# Altium schematic sheet MCU.SchDoc
size A4
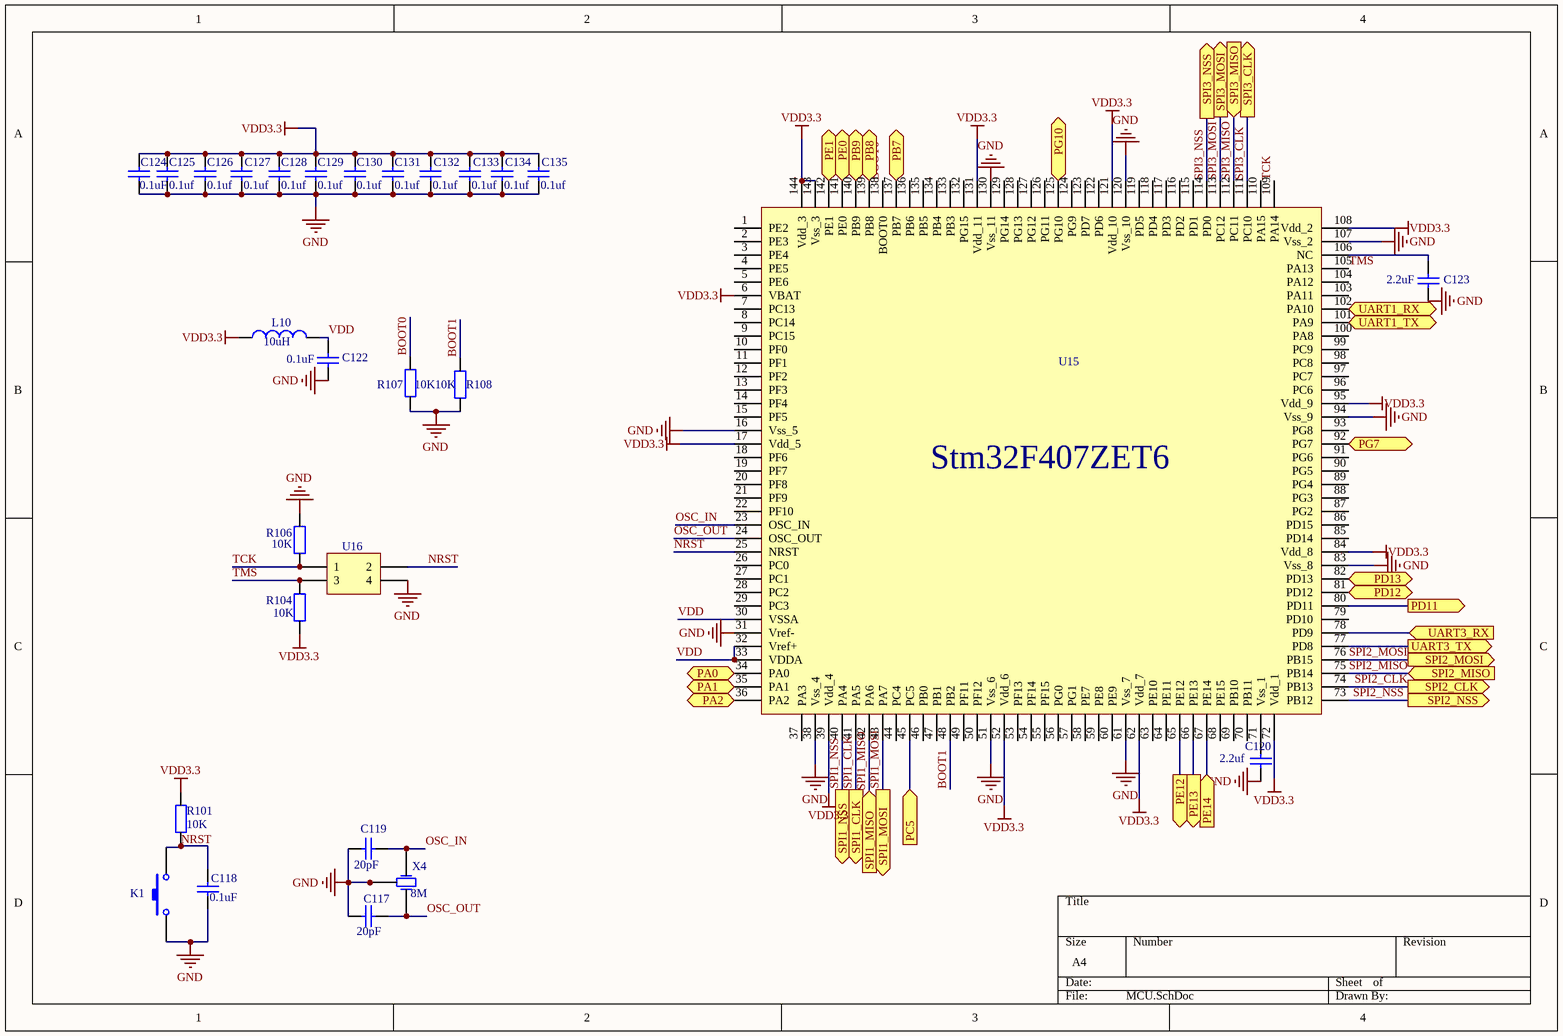
[diagram p0: MCU.SchDoc]

## Parts
C117  value 20pF  [0603]  (hidden comment: Capacitor-0805)
C118  value 0.1uF  [0603]  (hidden comment: Capacitor-0805)
C119  value 20pF  [0603]  (hidden comment: Capacitor-0805)
C120  value 2.2uf  [0603]  (hidden comment: Capacitor-0603)
C122  value 0.1uF  [0603]  (hidden comment: Capacitor-0805)
C123  value 2.2uF  [0603]  (hidden comment: Capacitor-0603)
C124  value 0.1uF  [0603]  (hidden comment: Capacitor-0805)
C125  value 0.1uf  [0603]  (hidden comment: Capacitor-0805)
C126  value 0.1uf  [0603]  (hidden comment: Capacitor-0805)
C127  value 0.1uf  [0603]  (hidden comment: Capacitor-0805)
C128  value 0.1uf  [0603]  (hidden comment: Capacitor-0805)
C129  value 0.1uf  [0603]  (hidden comment: Capacitor-0805)
C130  value 0.1uf  [0603]  (hidden comment: Capacitor-0805)
C131  value 0.1uf  [0603]  (hidden comment: Capacitor-0805)
C132  value 0.1uf  [0603]  (hidden comment: Capacitor-0805)
C133  value 0.1uf  [0603]  (hidden comment: Capacitor-0805)
C134  value 0.1uf  [0603]  (hidden comment: Capacitor-0805)
C135  value 0.1uf  [0603]  (hidden comment: Capacitor-0805)
K1  按键  [贴片按键]  (value not drawn)
L10  value 10uH  [0805]  (hidden comment: Inductor)
R101  value 10K  [0603]  (hidden comment: Resistor-0805)
R104  value 10K  [0603]  (hidden comment: Resistor-0805)
R106  value 10K  [0603]  (hidden comment: Resistor-0805)
R107  value 10K  [0603]  (hidden comment: Resistor-0805)
R108  value 10K  [0603]  (hidden comment: Resistor-0805)
U15  STM32F407ZET6  [Stm32f407ZET6 - duplicate]  (value not drawn)
U16  Header 2X2  [HDR2X2]  (value not drawn)
X4  value 8M  [3225无源晶振]  (hidden comment: 3225无源晶振)

## Ports
PA0 (in), PA1 (out), PA2 (out), PB7 (out), PB8 (out), PB9 (out), PC5 (in), PD11 (out), PD12, PD13, PE0 (out), PE1 (out), PE12 (out), PE13 (out), PE14 (in), PG7 (out), PG10 (out), SPI1_CLK (out), SPI1_MISO (in), SPI1_MOSI (out), SPI1_NSS (out), SPI2_CLK (out), SPI2_MISO (in), SPI2_MOSI (out), SPI2_NSS (out), SPI3_CLK (out), SPI3_MISO (in), SPI3_MOSI (out), SPI3_NSS (out), UART1_RX (in), UART1_TX (out), UART3_RX (in), UART3_TX (out)

## Nets
GND: C117.1 C118.1 C119.1 C120.1 C122.1 C123.1 C124.1 C125.1 C126.1 C127.1 C128.1 C129.1 C130.1 C131.1 C132.1 C133.1 C134.1 C135.1 K1.1 R106.2 R107.1 R108.1 U15.16(Vss_5) U15.31(Vref-) U15.38(Vss_4) U15.51(Vss_6) U15.61(Vss_7) U15.83(Vss_8) U15.94(Vss_9) U15.107(Vss_2) U15.120(Vss_10) U15.130(Vss_11) U16.4 X4.2(GND) X4.4(GND)
VDD3.3: C124.2 C125.2 C126.2 C127.2 C128.2 C129.2 C130.2 C131.2 C132.2 C133.2 C134.2 C135.2 L10.1 R101.2 R104.1 U15.6(VBAT) U15.17(Vdd_5) U15.39(Vdd_4) U15.52(Vdd_6) U15.62(Vdd_7) U15.72(Vdd_1) U15.84(Vdd_8) U15.95(Vdd_9) U15.108(Vdd_2) U15.121(Vdd_10) U15.131(Vdd_11) U15.143(Vss_3) U15.144(Vdd_3)
BOOT0: R107.2 U15.138(BOOT0)
BOOT1: R108.2 U15.48(PB2)
NRST: C118.2 K1.2 R101.1 U15.25(NRST) U16.2
OSC_IN: C119.2 U15.23(OSC_IN) X4.1(OSC1)
OSC_OUT: C117.2 U15.24(OSC_OUT) X4.3(OSC2)
PA0: U15.34(PA0) ; port PA0
PA1: U15.35(PA1) ; port PA1
PA2: U15.36(PA2) ; port PA2
PB7: U15.137(PB7) ; port PB7
PB8: U15.139(PB8) ; port PB8
PB9: U15.140(PB9) ; port PB9
PC5: U15.45(PC5) ; port PC5
PD11: U15.80(PD11) ; port PD11
PD12: U15.81(PD12) ; port PD12
PD13: U15.82(PD13) ; port PD13
PE0: U15.141(PE0) ; port PE0
PE1: U15.142(PE1) ; port PE1
PE12: U15.65(PE12) ; port PE12
PE13: U15.66(PE13) ; port PE13
PE14: U15.67(PE14) ; port PE14
PG7: U15.92(PG7) ; port PG7
PG10: U15.125(PG10) ; port PG10
SPI1_CLK: U15.41(PA5) ; port SPI1_CLK
SPI1_MISO: U15.42(PA6) ; port SPI1_MISO
SPI1_MOSI: U15.43(PA7) ; port SPI1_MOSI
SPI1_NSS: U15.40(PA4) ; port SPI1_NSS
SPI2_CLK: U15.74(PB13) ; port SPI2_CLK
SPI2_MISO: U15.75(PB14) ; port SPI2_MISO
SPI2_MOSI: U15.76(PB15) ; port SPI2_MOSI
SPI2_NSS: U15.73(PB12) ; port SPI2_NSS
SPI3_CLK: U15.111(PC10) ; port SPI3_CLK
SPI3_MISO: U15.112(PC11) ; port SPI3_MISO
SPI3_MOSI: U15.113(PC12) ; port SPI3_MOSI
SPI3_NSS: U15.114(PD0) ; port SPI3_NSS
TCK: R106.1 U15.109(PA14) U16.1
TMS: R104.2 U15.105(PA13) U16.3
UART1_RX: U15.102(PA10) ; port UART1_RX
UART1_TX: U15.101(PA9) ; port UART1_TX
UART3_RX: U15.78(PD9) ; port UART3_RX
UART3_TX: U15.77(PD8) ; port UART3_TX
VDD: C122.2 L10.2 U15.30(VSSA) U15.32(Vref+) U15.33(VDDA)
NetC120_2: C120.2 U15.71(Vss_1)
NetC123_2: C123.2 U15.106(NC)

Not connected (* = marked no-connect by the designer): U15 1(PE2) 2(PE3) 3(PE4) 4(PE5) 5(PE6) 7(PC13) 8(PC14) 9(PC15) 10(PF0) 11(PF1) 12(PF2) 13(PF3) 14(PF4) 15(PF5) 18(PF6) 19(PF7) 20(PF8) 21(PF9) 22(PF10) 26(PC0) 27(PC1) 28(PC2) 29(PC3) 37(PA3) 44(PC4) 46(PB0) 47(PB1) 49(PF11) 50(PF12) 53(PF13) 54(PF14) 55(PF15) 56(PG0) 57(PG1) 58(PE7) 59(PE8) 60(PE9) 63(PE10) 64(PE11) 68(PE15) 69(PB10) 70(PB11) 79(PD10) 85(PD14) 86(PD15) 87(PG2) 88(PG3) 89(PG4) 90(PG5) 91(PG6) 93(PG8) 96(PC6) 97(PC7) 98(PC8) 99(PC9) 100(PA8) 103(PA11) 104(PA12) 110(PA15) 115(PD1) 116(PD2) 117(PD3) 118(PD4) 119(PD5) 122(PD6) 123(PD7) 124(PG9) 126(PG11) 127(PG12) 128(PG13) 129(PG14) 132(PG15) 133(PB3) 134(PB4) 135(PB5) 136(PB6)

## Notes on the sheet
- (in symbol STM32F407Z) Stm32F407ZET6

## Library data of the parts
C117-C119 = Capacitor-0
C122 C124-C135 = Capacitor
L10 = Ind
R101 R104 R106 = Resistor-0
R107 R108 = Resistor
U15 = STM32F407Z: Value: STM32F407ZGT6
U16 = Header 2X2: Header, 2-Pin, Dual row; LatestRevisionDate: 17-Jul-2002; LatestRevisionNote: Re-released for DXP Platform.; Publisher: Altium Limited